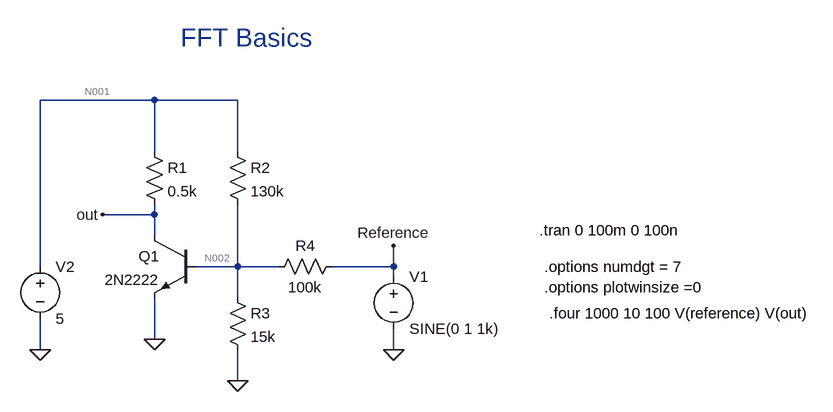
[diagram p0: schematic Fourier_basics.asc]
Fourier_basics.asc, the LTspice schematic file:
Version 4
SHEET 1 880 680
WIRE -208 -112 -384 -112
WIRE -80 -112 -208 -112
WIRE -208 -32 -208 -112
WIRE -80 -32 -80 -112
WIRE -208 64 -208 48
WIRE -208 64 -288 64
WIRE -208 96 -208 64
WIRE -384 144 -384 -112
WIRE -80 144 -80 48
WIRE -80 144 -144 144
WIRE -16 144 -80 144
WIRE 160 144 160 112
WIRE 160 144 64 144
WIRE 160 160 160 144
WIRE -80 192 -80 144
WIRE -208 256 -208 192
WIRE -384 272 -384 224
WIRE 160 272 160 240
WIRE -80 320 -80 272
FLAG 160 272 0
FLAG 160 112 Reference
FLAG -384 272 0
FLAG -80 320 0
FLAG -208 256 0
FLAG -288 64 out
SYMBOL voltage 160 144 R0
WINDOW 123 0 0 Left 0
WINDOW 39 0 0 Left 0
SYMATTR InstName V1
SYMATTR Value SINE(0 1 1k)
SYMBOL res -224 -48 R0
SYMATTR InstName R1
SYMATTR Value 0.5k
SYMBOL res -96 -48 R0
SYMATTR InstName R2
SYMATTR Value 130k
SYMBOL res -96 176 R0
SYMATTR InstName R3
SYMATTR Value 15k
SYMBOL res 80 128 R90
WINDOW 0 0 56 VBottom 2
WINDOW 3 32 56 VTop 2
SYMATTR InstName R4
SYMATTR Value 100k
SYMBOL voltage -384 128 R0
WINDOW 123 0 0 Left 0
WINDOW 39 0 0 Left 0
SYMATTR InstName V2
SYMATTR Value 5
SYMBOL npn -144 96 M0
SYMATTR InstName Q1
SYMATTR Value 2N2222
TEXT 384 88 Left 2 !.tran 0 100m 0 100n
TEXT 392 144 Left 2 !.options numdgt = 7
TEXT 392 176 Left 2 !.options plotwinsize =0
TEXT 400 216 Left 2 !.four 1000 10 100 V(reference) V(out)
TEXT -168 -208 Left 4 ;FFT Basics

The netlist it stands for:
* Fourier_basics.asc
V1 Reference 0 SINE(0 1 1k)
R1 N001 out 0.5k
R2 N001 N002 130k
R3 N002 0 15k
R4 Reference N002 100k
V2 N001 0 5
Q1 out N002 0 0 2N2222
.model NPN NPN
.model PNP PNP
.lib standard.bjt
.tran 0 100m 0 100n
.options numdgt = 7
.options plotwinsize =0
.four 1000 10 100 V(reference) V(out)
* FFT Basics
.backanno
.end

* Results of the author's LTspice run, read from the files saved beside the schematic
* Operating Point, zero values left out:
*   V(n001) = 5 V
*   V(out) = 5 V
*   V(n002) = 455.9 mV
*   Ic(Q1) = 472.3 nA
*   Ib(Q1) = 2.255 nA
*   Ie(Q1) = -474.6 nA
*   I(R4) = -4.559 µA
*   I(R3) = 30.39 µA
*   I(R2) = 34.95 µA
*   I(R1) = 472.3 nA
*   I(V2) = -35.43 µA
*   I(V1) = 4.559 µA
* From the log:
*   N-Period=100
*   Fourier components of V(reference)
*   DC component:6.90927e-017
*   Harmonic  Frequency   Fourier   Normalized   Phase    Normalized
*    Number     [Hz]     Component   Component  [degree]  Phase [deg]
*       1     1.000e+03  1.000e+00  1.000e+00     -0.00°      0.00°
*       2     2.000e+03  6.994e-15  6.994e-15     -0.14°     -0.14°
*       3     3.000e+03  1.075e-14  1.075e-14     -0.51°     -0.51°
*       4     4.000e+03  1.418e-14  1.418e-14     -0.17°     -0.17°
*       5     5.000e+03  1.774e-14  1.774e-14     -0.16°     -0.16°
*       6     6.000e+03  2.135e-14  2.135e-14     -0.15°     -0.15°
*       7     7.000e+03  2.487e-14  2.487e-14     -0.17°     -0.17°
*       8     8.000e+03  2.841e-14  2.841e-14     -0.23°     -0.23°
*       9     9.000e+03  3.203e-14  3.203e-14     -0.10°     -0.10°
*      10     1.000e+04  3.553e-14  3.553e-14     -0.17°     -0.17°
*   Total Harmonic Distortion: 0.000000%(0.000975%)
*   N-Period=100
*   Fourier components of V(out)
*   DC component:4.99584
*   Harmonic  Frequency   Fourier   Normalized   Phase    Normalized
*    Number     [Hz]     Component   Component  [degree]  Phase [deg]
*       1     1.000e+03  7.312e-03  1.000e+00    179.82°      0.00°
*       2     2.000e+03  5.018e-03  6.863e-01     89.65°    -90.16°
*       3     3.000e+03  2.745e-03  3.755e-01     -0.53°   -180.34°
*       4     4.000e+03  1.217e-03  1.665e-01    -90.71°   -270.53°
*       5     5.000e+03  4.394e-04  6.009e-02    179.09°     -0.72°
*       6     6.000e+03  1.261e-04  1.725e-02     88.88°    -90.94°
*       7     7.000e+03  2.591e-05  3.543e-03     -1.37°   -181.19°
*       8     8.000e+03  1.730e-06  2.366e-04    -92.13°   -271.94°
*       9     9.000e+03  1.538e-06  2.103e-04     -1.40°   -181.22°
*      10     1.000e+04  9.563e-07  1.308e-04    -91.75°   -271.57°
*   Total Harmonic Distortion: 80.228033%(80.228033%)